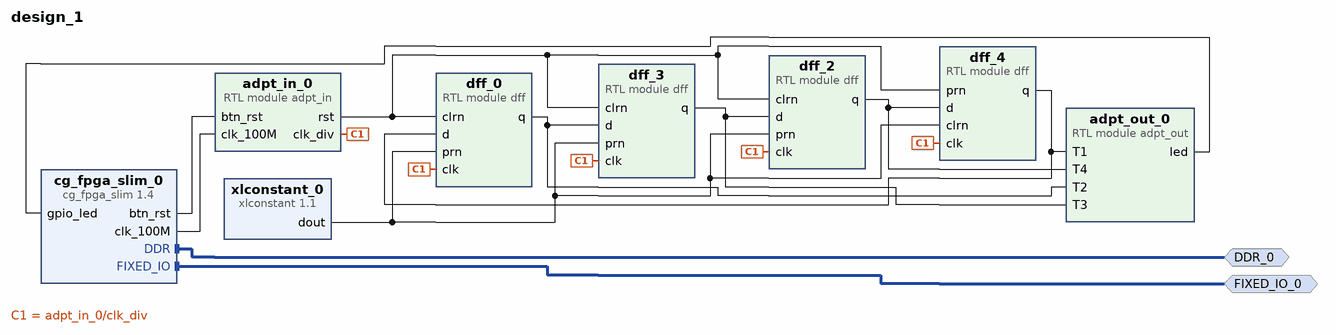
[diagram p0: block diagram of the top level]
# Vivado block design design_1, xc7z020clg400-1, Vivado 2024.2
create_bd_design design_1

create_bd_intf_port -mode Master -vlnv xilinx.com:interface:ddrx_rtl:1.0 DDR_0
create_bd_intf_port -mode Master -vlnv xilinx.com:display_processing_system7:fixedio_rtl:1.0 FIXED_IO_0

create_bd_cell -type ip -vlnv educg.net:user:cg_fpga_slim:1.4 cg_fpga_slim_0
create_bd_cell -type module -reference adpt_in adpt_in_0
create_bd_cell -type module -reference adpt_out adpt_out_0
create_bd_cell -type module -reference dff dff_0
create_bd_cell -type module -reference dff dff_2
create_bd_cell -type module -reference dff dff_3
create_bd_cell -type module -reference dff dff_4
create_bd_cell -type ip -vlnv xilinx.com:ip:xlconstant:1.1 xlconstant_0

# ---- connections ----

connect_bd_intf_net [get_bd_intf_ports DDR_0] [get_bd_intf_pins cg_fpga_slim_0/DDR]
connect_bd_intf_net [get_bd_intf_ports FIXED_IO_0] [get_bd_intf_pins cg_fpga_slim_0/FIXED_IO]
connect_bd_net [get_bd_pins adpt_in_0/clk_div] [get_bd_pins dff_4/clk] [get_bd_pins dff_0/clk] [get_bd_pins dff_3/clk] [get_bd_pins dff_2/clk]
connect_bd_net [get_bd_pins adpt_in_0/rst] [get_bd_pins dff_4/prn] [get_bd_pins dff_0/clrn] [get_bd_pins dff_3/clrn] [get_bd_pins dff_2/clrn]
connect_bd_net [get_bd_pins adpt_out_0/led] [get_bd_pins cg_fpga_slim_0/gpio_led]
connect_bd_net [get_bd_pins cg_fpga_slim_0/btn_rst] [get_bd_pins adpt_in_0/btn_rst]
connect_bd_net [get_bd_pins cg_fpga_slim_0/clk_100M] [get_bd_pins adpt_in_0/clk_100M]
connect_bd_net [get_bd_pins dff_0/q] [get_bd_pins dff_3/d] [get_bd_pins adpt_out_0/T2]
connect_bd_net [get_bd_pins dff_2/q] [get_bd_pins adpt_out_0/T4] [get_bd_pins dff_4/d]
connect_bd_net [get_bd_pins dff_3/q] [get_bd_pins dff_2/d] [get_bd_pins adpt_out_0/T3]
connect_bd_net [get_bd_pins dff_4/q] [get_bd_pins dff_0/d] [get_bd_pins adpt_out_0/T1]
connect_bd_net [get_bd_pins xlconstant_0/dout] [get_bd_pins dff_4/clrn] [get_bd_pins dff_0/prn] [get_bd_pins dff_3/prn] [get_bd_pins dff_2/prn]

validate_bd_design
save_bd_design
